# Altium schematic sheet ole_minifat.SchDoc
size A4
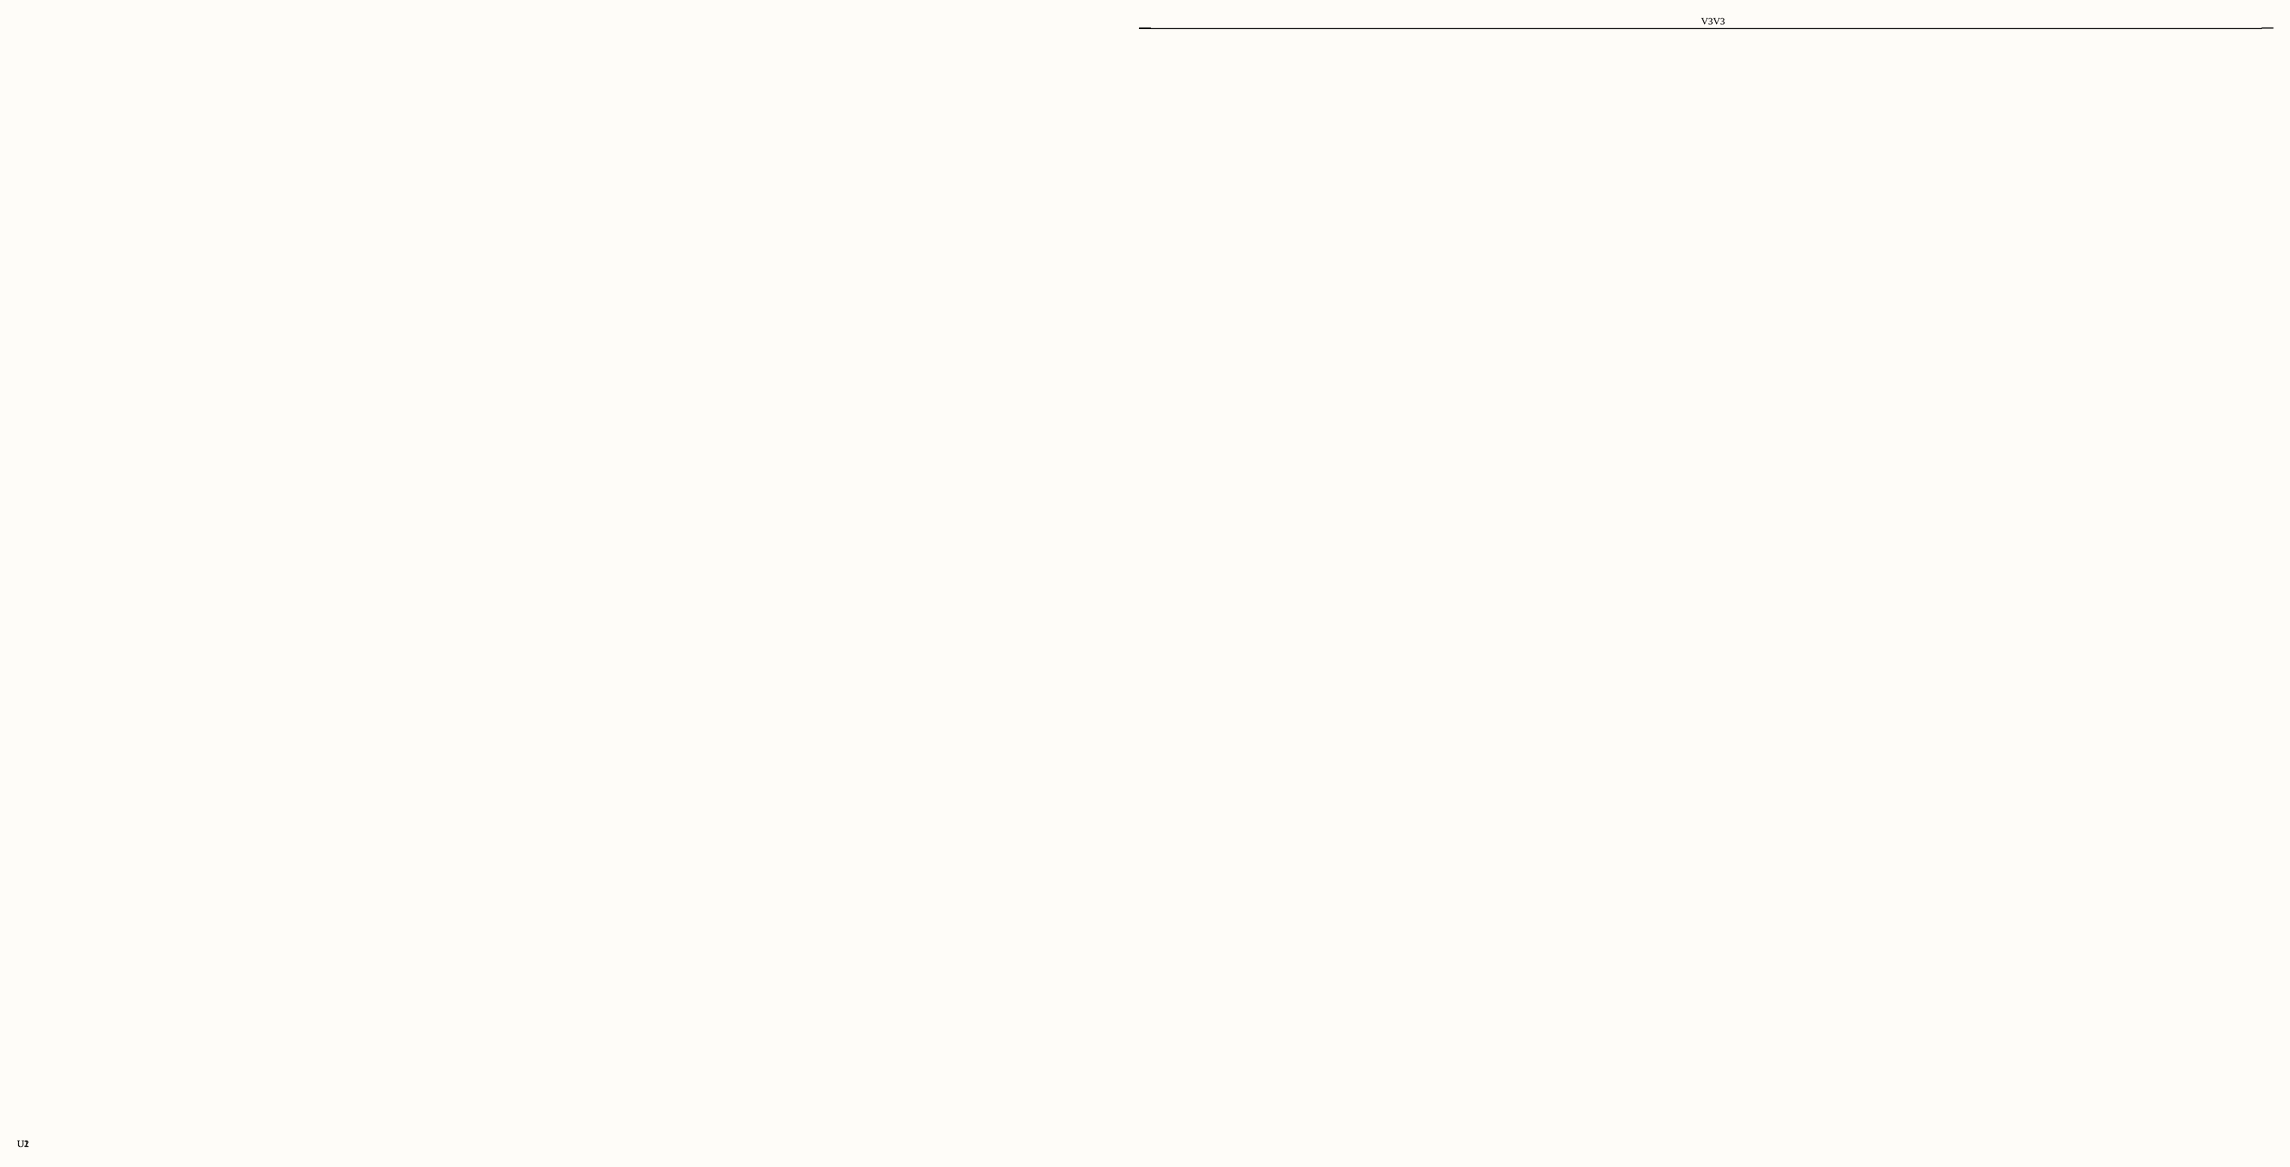
[diagram p0: ole_minifat.SchDoc]

## Parts
U1  (no value)
U2  (no value)

## Nets
V3V3: U1.1(P0.25) U2.1(VDD)

## Library data of the parts
U1 = RES
U2 = CAP